# Altium schematic sheet 10 CAN.SchDoc
size 513 x 386 mm
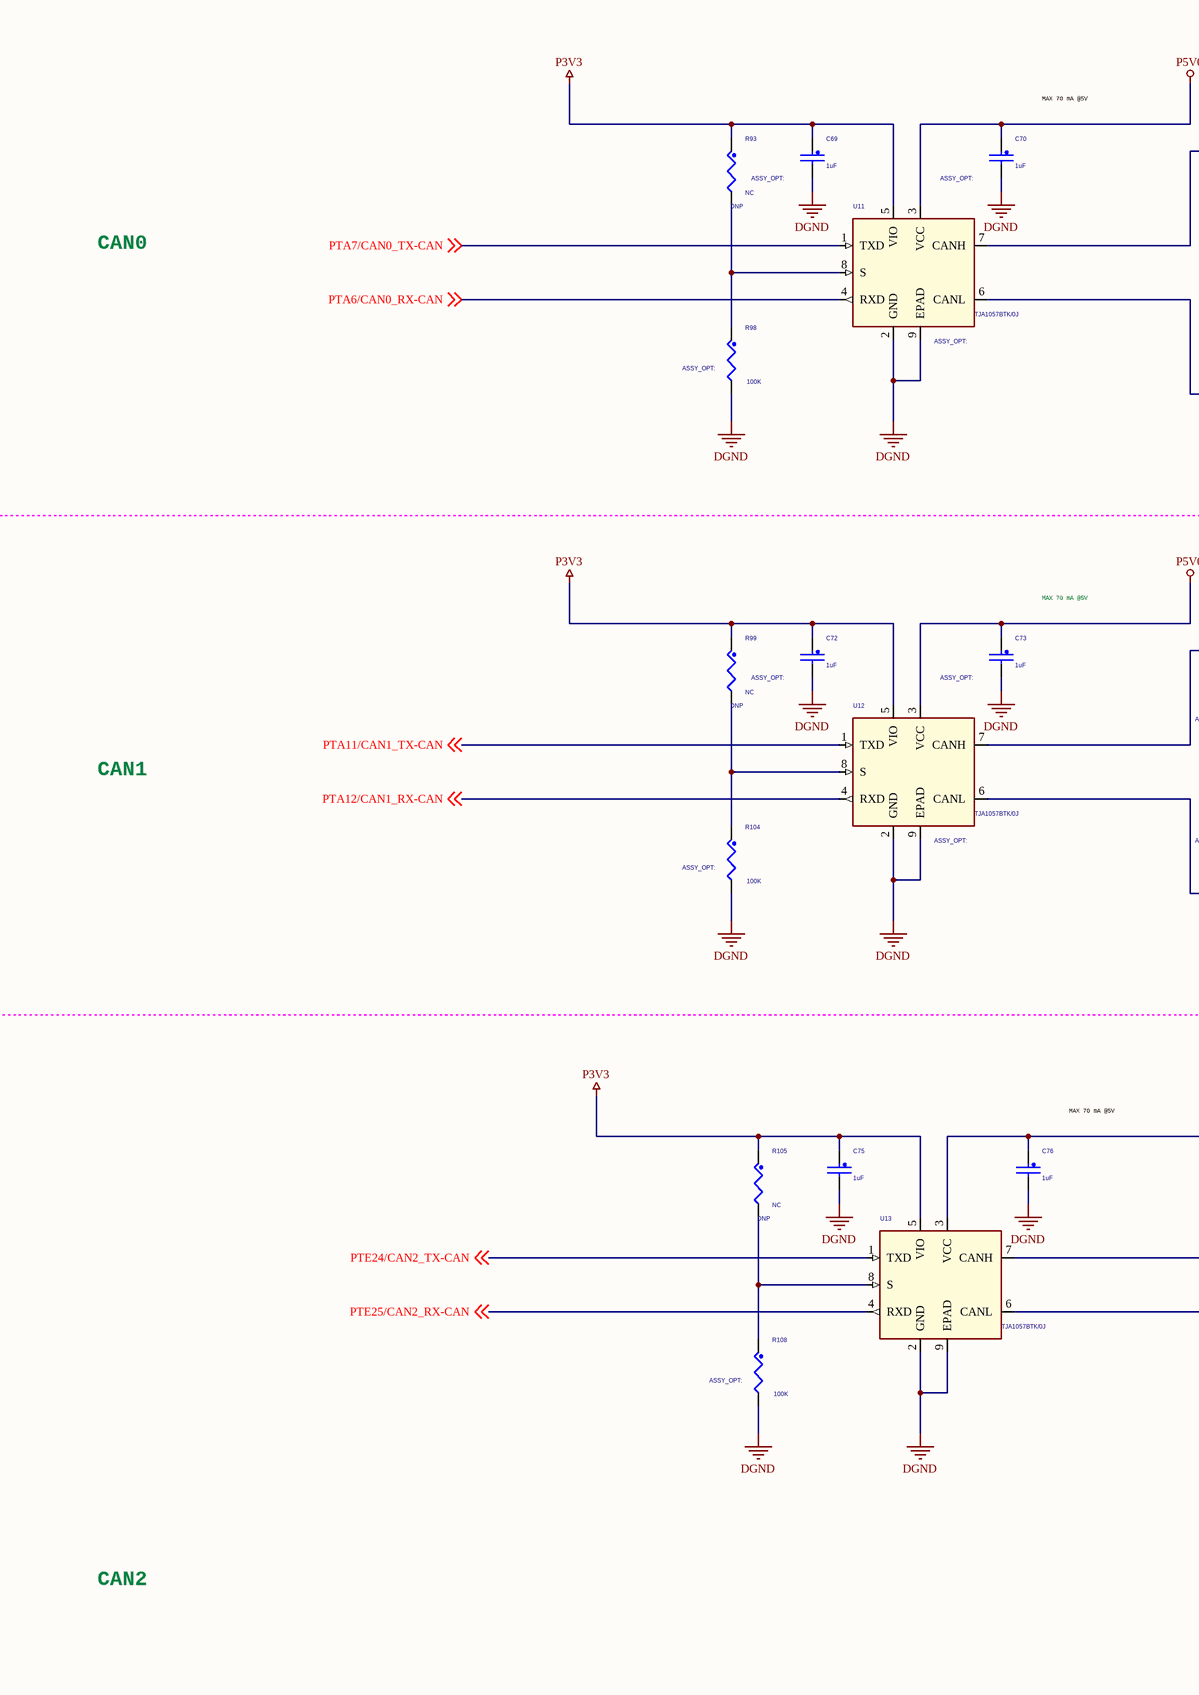
[diagram p0: 10 CAN.SchDoc, left]
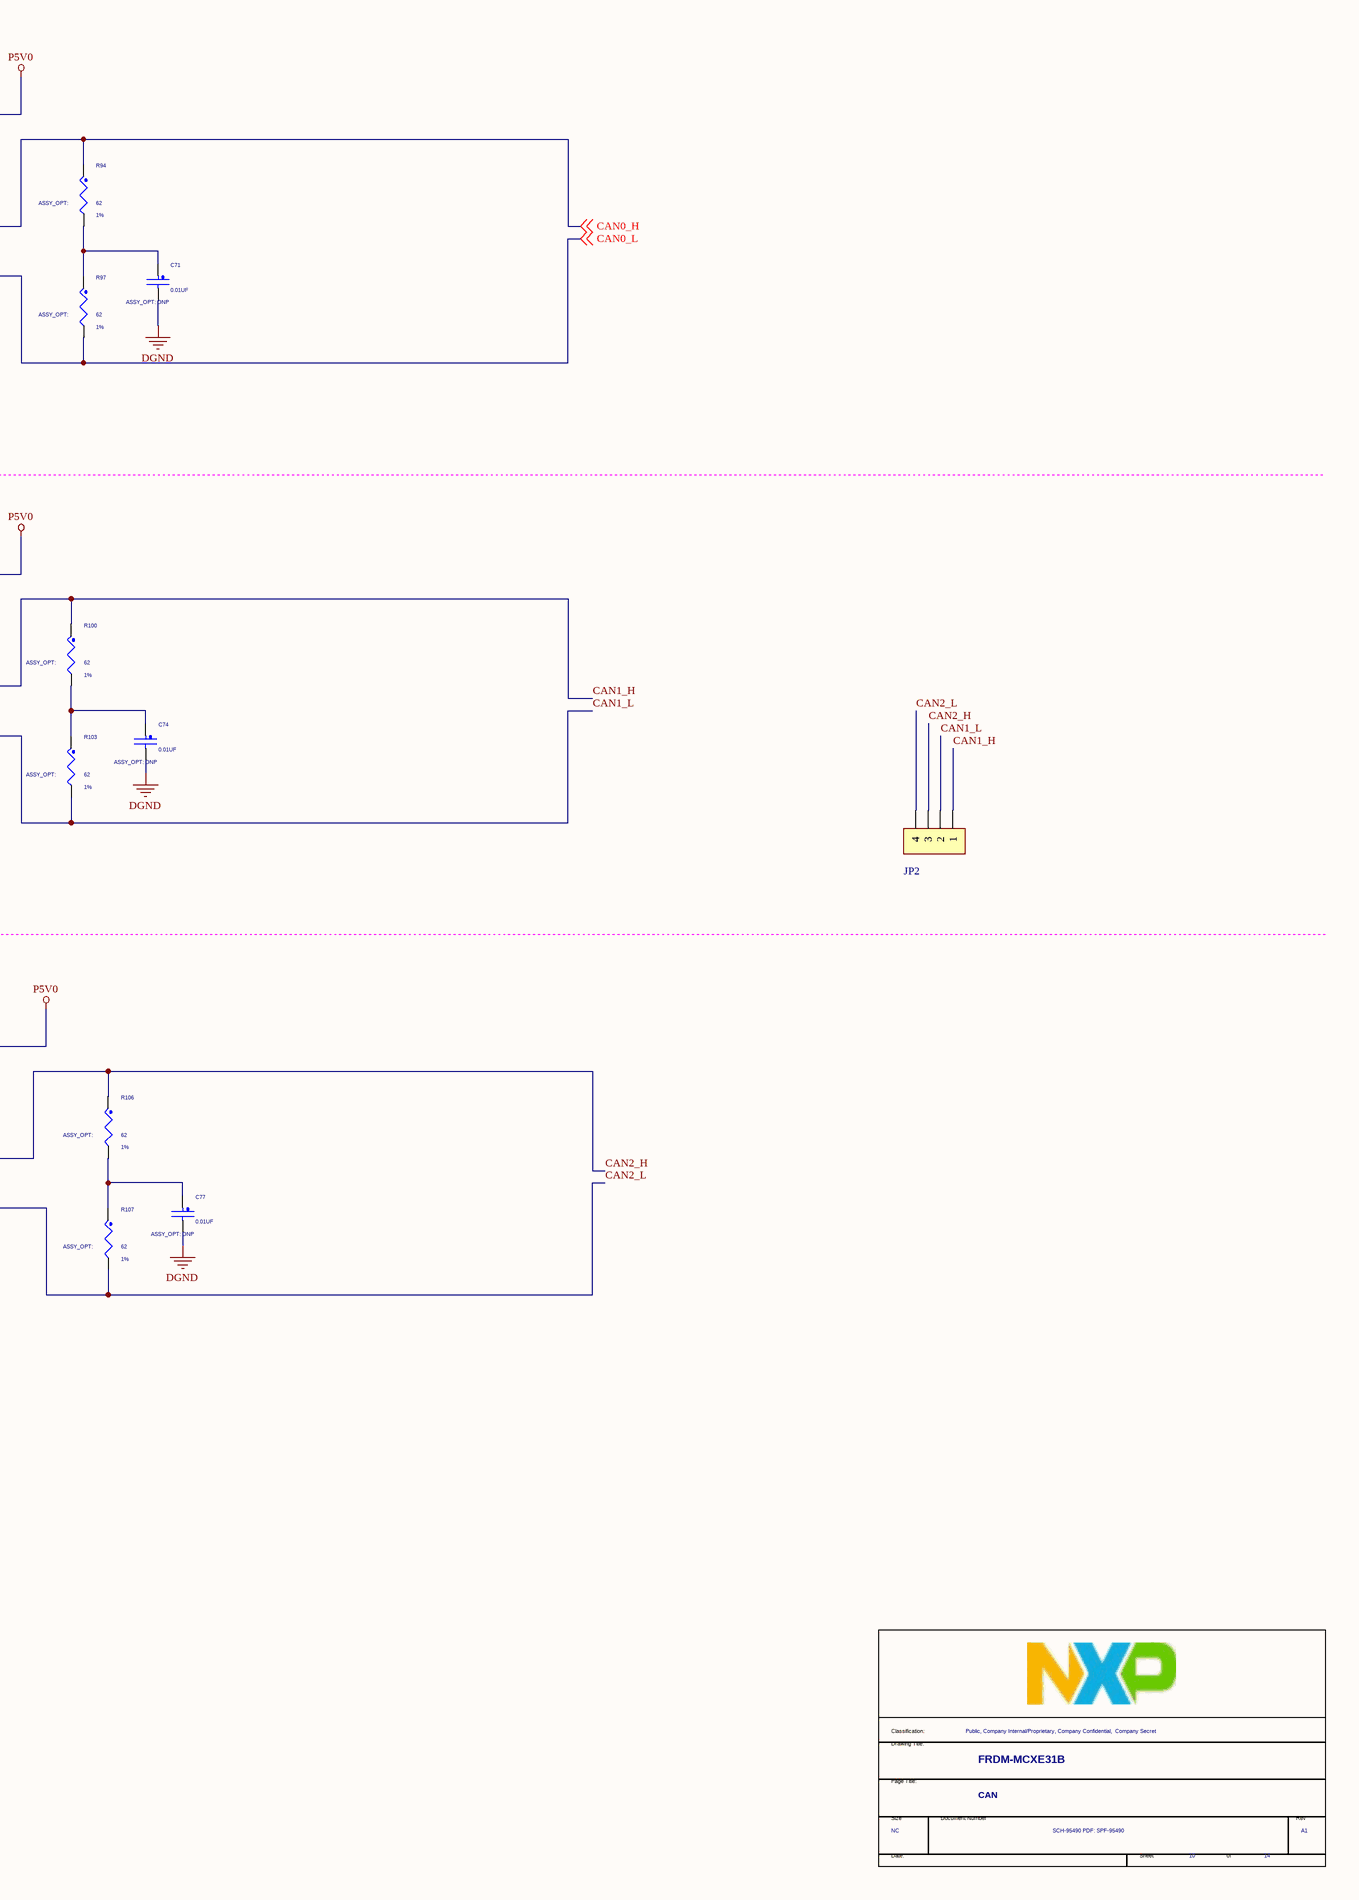
[diagram p1: 10 CAN.SchDoc, right]

## Parts
*  Title: FRDM-MCXE31B  RevCode: A1  PageTitle: CAN  Page Size: NC  Page Number: 10  Page Count: 14  Doc: SCH-95490 PDF: SPF-95490  Classification: Public, Company Internal/Proprietary, Company Confidential,  Company Secret  (hidden comment: TitleBlock_FS)  (graphical)
C69  1uF  [CC0402_25]
C70  1uF  [CC0402_25]
C71  0.01UF  ASSY_OPT: DNP  [CC0402_25]
C72  1uF  [CC0402_25]
C73  1uF  [CC0402_25]
C74  0.01UF  ASSY_OPT: DNP  [CC0402_25]
C75  1uF  [CC0402_25]
C76  1uF  [CC0402_25]
C77  0.01UF  ASSY_OPT: DNP  [CC0402_25]
JP2  HDR-1X4  [KF128-3.81-4P]  (value not drawn)
R93  NC  ASSY_OPT: DNP  [RC0402_25]
R94  62  Tolerance: 1%  [RC0805_OV]
R97  62  Tolerance: 1%  [RC0805_OV]
R98  100K  [RC0402_25]
R99  NC  ASSY_OPT: DNP  [RC0402_25]
R100  62  Tolerance: 1%  [RC0805_OV]
R103  62  Tolerance: 1%  [RC0805_OV]
R104  100K  [RC0402_25]
R105  NC  ASSY_OPT: DNP  [RC0402_25]
R106  62  Tolerance: 1%  [RC0805_OV]
R107  62  Tolerance: 1%  [RC0805_OV]
R108  100K  [RC0402_25]
U11  MFG_PN01: TJA1057BTK/0J  [son8_0p65_3p15x3p15]  (hidden comment: TJA1057BTK)
U12  MFG_PN01: TJA1057BTK/0J  [son8_0p65_3p15x3p15]  (hidden comment: TJA1057BTK)
U13  MFG_PN01: TJA1057BTK/0J  [son8_0p65_3p15x3p15]  (hidden comment: TJA1057BTK)

## Nets
DGND: C69.2 C70.2 C71.2 C72.2 C73.2 C74.2 C75.2 C76.2 C77.2 R98.2 R104.2 R108.2 U11.2(GND) U11.9(EPAD) U12.2(GND) U12.9(EPAD) U13.2(GND) U13.9(EPAD)
P3V3: C69.1 C72.1 C75.1 R93.1 R99.1 R105.1 U11.5(VIO) U12.5(VIO) U13.5(VIO)
P5V0: C70.1 C73.1 C76.1 U11.3(VCC) U12.3(VCC) U13.3(VCC)
CAN0_H: R94.1 U11.7(CANH) ; off-sheet CAN0_H
CAN0_L: R97.2 U11.6(CANL) ; off-sheet CAN0_L
CAN1_H: JP2.1 R100.1 U12.7(CANH)
CAN1_L: JP2.2 R103.2 U12.6(CANL)
CAN2_H: JP2.3 R106.1 U13.7(CANH)
CAN2_L: JP2.4 R107.2 U13.6(CANL)
PTA6/CAN0_RX-CAN: U11.4(RXD) ; off-sheet PTA6/CAN0_RX-CAN
PTA7/CAN0_TX-CAN: U11.1(TXD) ; off-sheet PTA7/CAN0_TX-CAN
PTA11/CAN1_TX-CAN: U12.1(TXD) ; off-sheet PTA11/CAN1_TX-CAN
PTA12/CAN1_RX-CAN: U12.4(RXD) ; off-sheet PTA12/CAN1_RX-CAN
PTE24/CAN2_TX-CAN: U13.1(TXD) ; off-sheet PTE24/CAN2_TX-CAN
PTE25/CAN2_RX-CAN: U13.4(RXD) ; off-sheet PTE25/CAN2_RX-CAN
NetC71_1: C71.1 R94.2 R97.1
NetC74_1: C74.1 R100.2 R103.1
NetC77_1: C77.1 R106.2 R107.1
NetR93_2: R93.2 R98.1 U11.8(S)
NetR99_2: R99.2 R104.1 U12.8(S)
NetR105_2: R105.2 R108.1 U13.8(S)

## Notes on the sheet
- MAX 70 mA @5V
- CAN0
- CAN1
- CAN2
- (in symbol TitleBlock_FS) Classification:; Drawing Title:; Page Title:; Size; Document Number; Rev; Date:; Sheet; of

## Library data of the parts
* = TitleBlock_FS: Variant Name: <Core Design>; OrgAddr2: Austin, TX 78735-8598; OrgAddr1: 6501 William Cannon Drive West; OrgName: NXP Semiconductors; Classification: Company Internal/Proprietary; Page Create Date: March  8, 1995
C69 C70 C75 = CAP_NP: CAP CER 1.0uF 16V 10% X6S 0402; CLASS: DISCRETE; Temp Range: -55C to +105C; FPLIST: CC0402_25,CC0402_HD,0402_CC,capc0402_l; CAD_APPROVED: Yes; MFG_PN01: GRM155C81C105KE11D; MFG_NAME01: MURATA; AGILE_PN: 150-80262; SIGNAL_MODEL: DEFAULT_CAPACITOR_1e+06pF_2_1; Temp_Range: -55癈 to +125癈; Rated Voltage: 16V; VOLTAGE: 16V; HEIGHT: 0.55; ROHS: Yes; Tolerance: 10%
C71 = CAP_NP: CAP CER 0.01UF 50V 10% X7R 0402; CLASS: DISCRETE; AGILE_PN: 150-30114; FPLIST: CC0402_25,CC0402_HD,0402_CC,capc0402_l; CAD_APPROVED: Yes; Temp Range: -55C to +125C; MFG_NAME01: MURATA; MFG_PN01: GRM155R71H103KA88D; HEIGHT: 0.55MM; Tolerance: 10%; Rated Voltage: 50V; ROHS: NULL
C72 C73 C76 = CAP_NP: CAP CER 1.0uF 16V 10% X6S 0402; CLASS: DISCRETE; Temp_Range: -55癈 to +125癈; SIGNAL_MODEL: DEFAULT_CAPACITOR_1e+06pF_2_1; AGILE_PN: 150-80262; MFG_NAME01: MURATA; MFG_PN01: GRM155C81C105KE11D; CAD_APPROVED: Yes; FPLIST: CC0402_25,CC0402_HD,0402_CC,capc0402_l; Temp Range: -55C to +105C; Tolerance: 10%; ROHS: Yes; HEIGHT: 0.55; VOLTAGE: 16V; Rated Voltage: 16V
C74 C77 = CAP_NP: CAP CER 0.01UF 50V 10% X7R 0402; CLASS: DISCRETE; MFG_PN01: GRM155R71H103KA88D; MFG_NAME01: MURATA; Temp Range: -55C to +125C; CAD_APPROVED: Yes; FPLIST: CC0402_25,CC0402_HD,0402_CC,capc0402_l; AGILE_PN: 150-30114; ROHS: NULL; Rated Voltage: 50V; Tolerance: 10%; HEIGHT: 0.55MM
JP2 = Header 4: 4P接插件; BOM名称: 4P接插件
R93 R105 = RES: RES MF 10K 1/16W 5% 0402; CLASS: DISCRETE; FPLIST: RC0402_25,RC0402_HD,0402_CC; CAD_APPROVED: Yes; MFG_PN01: CR0402-JW-103GLF; MFG_NAME01: BOURNS; AGILE_PN: 470-75557; SIGNAL_MODEL: DEFAULT_RESISTOR_10000OHM_2_1; Temp_Range: ?5 癈 to +155 癈; HEIGHT: 0.4MM; TOL: 5%; ROHS: NULL; Tolerance: 5%
R94 R100 R103 = RES: RES MF 62 OHM 1/4W 1% AEC-Q200 0805; CLASS: DISCRETE; MFG_PN01: SG73P2ATTD62R0F; MFG_NAME01: KOA SPEER; Temp Range: -55 °C to +155 °C; CAD_APPROVED: Yes; FPLIST: RC0805_OV,RC0805,0805_CC; AGILE_PN: 470-83214; 3D_Mechanical_Footprint_File: http://fcl.am.freescale.net/ALLEGRO/step/RC0805_OV.STEP; ROHS: Yes; HEIGHT: 0.60; Package Size: 0805 (2012 Metric)
R97 R106 R107 = RES: RES MF 62 OHM 1/4W 1% AEC-Q200 0805; CLASS: DISCRETE; AGILE_PN: 470-83214; FPLIST: RC0805_OV,RC0805,0805_CC; CAD_APPROVED: Yes; Temp Range: -55 °C to +155 °C; MFG_NAME01: KOA SPEER; MFG_PN01: SG73P2ATTD62R0F; Package Size: 0805 (2012 Metric); HEIGHT: 0.60; ROHS: Yes; 3D_Mechanical_Footprint_File: http://fcl.am.freescale.net/ALLEGRO/step/RC0805_OV.STEP
R98 R108 = RES: RES MF 100K 1/16W 1% 0402; CLASS: DISCRETE; MFG_PN01: CRCW0402100KFKEDC; MFG_NAME01: VISHAY INTERTECHNOLOGY; CAD_APPROVED: Yes; FPLIST: RC0402_25,RC0402_HD,0402_CC; AGILE_PN: 470-76240; ROHS: Yes; Tolerance: 1%; HEIGHT: 0.4
R99 = RES: RES MF 10K 1/16W 5% 0402; CLASS: DISCRETE; Temp_Range: ?5 癈 to +155 癈; SIGNAL_MODEL: DEFAULT_RESISTOR_10000OHM_2_1; AGILE_PN: 470-75557; MFG_NAME01: BOURNS; MFG_PN01: CR0402-JW-103GLF; CAD_APPROVED: Yes; FPLIST: RC0402_25,RC0402_HD,0402_CC; Tolerance: 5%; ROHS: NULL; TOL: 5%; HEIGHT: 0.4MM
R104 = RES: RES MF 100K 1/16W 1% 0402; CLASS: DISCRETE; AGILE_PN: 470-76240; FPLIST: RC0402_25,RC0402_HD,0402_CC; CAD_APPROVED: Yes; MFG_NAME01: VISHAY INTERTECHNOLOGY; MFG_PN01: CRCW0402100KFKEDC; HEIGHT: 0.4; Tolerance: 1%; ROHS: Yes
U11 U12 = TJA1051TK_3_HVSON8: IC XCVR CAN 4.5-5.5V AEC-Q100 HVSON8; MFG_NAME01: NXP Semiconductor; CAD_APPROVED: Yes; Supply Voltage: 4.5 V to 5.5 V; AGILE_PN: 312-10381; CLASS: IC; 3D_Mechanical_Footprint_File: http://fcl.am.freescale.net/ALLEGRO/step/son8_0p65_3p15x3p15.STEP; ROHS: NULL; HEIGHT: 1mm; Package Size: HVSON-8
U13 = TJA1051TK_3_HVSON8: IC XCVR CAN 4.5-5.5V AEC-Q100 HVSON8; AGILE_PN: 312-10381; Supply Voltage: 4.5 V to 5.5 V; CAD_APPROVED: Yes; MFG_NAME01: NXP Semiconductor; CLASS: IC; Package Size: HVSON-8; HEIGHT: 1mm; ROHS: NULL; 3D_Mechanical_Footprint_File: http://fcl.am.freescale.net/ALLEGRO/step/son8_0p65_3p15x3p15.STEP